# Altium schematic sheet 09.SchDoc
size 297 x 209 mm
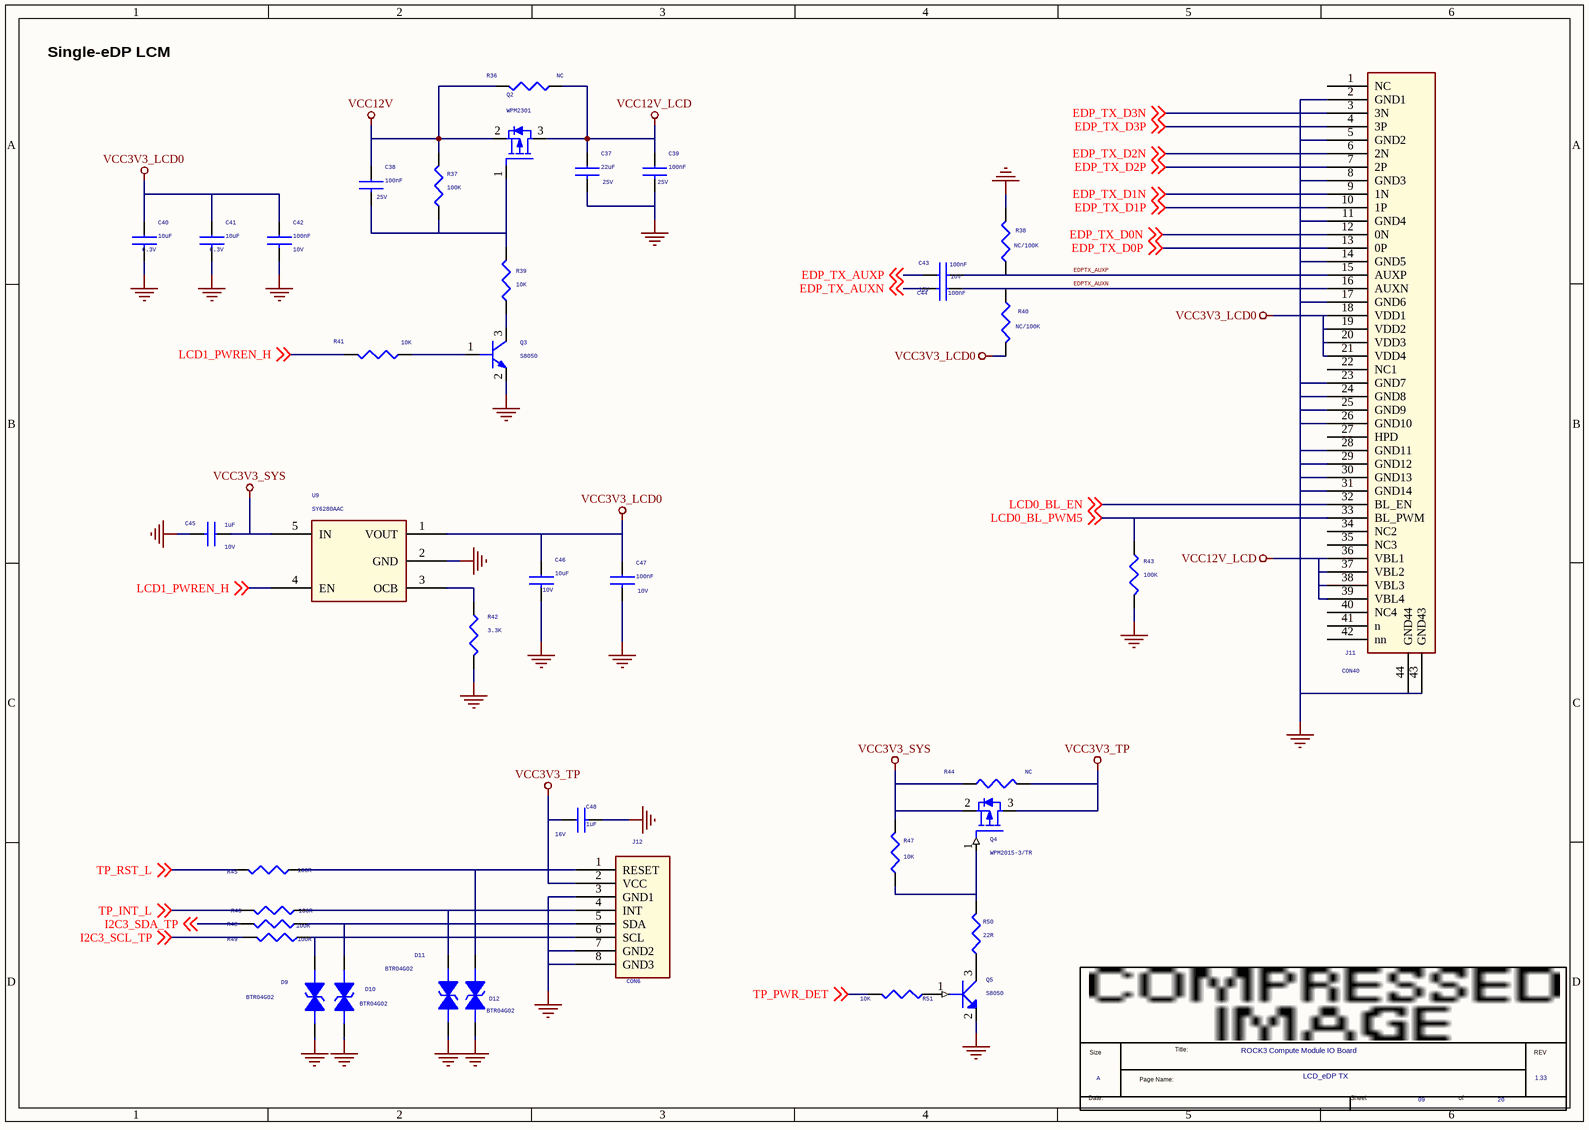
[diagram p0: 09.SchDoc]

## Parts
*  Page Count: 20  Page Number: 09  Page Size: A  Title: ROCK3 Compute Module IO Board  RevCode: 1.33  Doc: LCD_eDP TX  (hidden comment: radxa_1010)  (graphical)
C37  22uF  Voltage: 25V  [C0805]
C38  100nF  Voltage: 25V  [C0402]
C39  100nF  Voltage: 25V  [C0402]
C40  10uF  Voltage: 6.3V  [C0603]
C41  10uF  Voltage: 6.3V  [C0603]
C42  100nF  Voltage: 10V  [C0402]
C43  100nF  Voltage: 10V  [C0402]
C44  100nF  Voltage: 10V  [C0402]
C45  1uF  Voltage: 10V  [C0402]
C46  10uF  Voltage: 10V  [C0603]
C47  100nF  Voltage: 10V  [C0402]
C48  1uF  Voltage: 16V  [C0402]
D9  BTR04G02  [ESD0402_1xD5]
D10  BTR04G02  [ESD0402_1xD5]
D11  BTR04G02  [ESD0402_1xD5]
D12  BTR04G02  [ESD0402_1xD5]
J11  CON40  [20455-040E-TOP]
J12  CON6  [FPC6-0.5MM-2660H]
Q2  WPM2301  [SOT23]
Q3  S8050  [SOT23]
Q4  WPM2015-3/TR  [SOT23]
Q5  S8050  [SOT23]
R36  NC  [R0402]
R37  100K  [R0402]
R38  NC/100K  [R0402]
R39  10K  [R0402]
R40  NC/100K  [R0402]
R41  10K  [R0402]
R42  3.3K  [R0402]
R43  100K  [R0402]
R44  NC  [R0402]
R45  100R  [R0402]
R46  100R  [R0402]
R47  10K  [R0402]
R48  100R  [R0402]
R49  100R  [R0402]
R50  22R  [R0402]
R51  10K  [R0402]
U9  SY6280AAC  [SOT_23_5]

## Nets
GND: C37.2 C39.2 C40.2 C41.2 C42.2 C45.2 C46.2 C47.2 C48.2 D9.1 D10.1 D11.1 D12.1 J11.2(GND1) J11.5(GND2) J11.8(GND3) J11.11(GND4) J11.14(GND5) J11.17(GND6) J11.23(GND7) J11.24(GND8) J11.25(GND9) J11.26(GND10) J11.28(GND11) J11.29(GND12) J11.30(GND13) J11.31(GND14) J11.43(GND43) J11.44(GND44) J12.3(GND1) J12.7(GND2) J12.8(GND3) Q3.2(EMITTER) Q5.2(E) R38.1 R42.2 R43.2 U9.2(GND)
VCC3V3_LCD0: C40.1 C41.1 C42.1 C46.1 C47.1 J11.18(VDD1) J11.19(VDD2) J11.20(VDD3) J11.21(VDD4) R40.2 U9.1(VOUT)
VCC3V3_SYS: C45.1 Q4.2(SOURCE) R44.1 R47.2 U9.5(IN)
VCC3V3_TP: C48.1 J12.2(VCC) Q4.3(DRAIN) R44.2
VCC12V: C38.1 Q2.2(SOURCE) R36.1 R37.1
VCC12V_LCD: C37.1 C39.1 J11.36(VBL1) J11.37(VBL2) J11.38(VBL3) J11.39(VBL4) Q2.3(DRAIN) R36.2
EDP_TX_AUXN: C44.2 ; off-sheet EDP_TX_AUXN
EDP_TX_AUXP: C43.1 ; off-sheet EDP_TX_AUXP
EDP_TX_D0N: J11.12(0N) ; off-sheet EDP_TX_D0N
EDP_TX_D0P: J11.13(0P) ; off-sheet EDP_TX_D0P
EDP_TX_D1N: J11.9(1N) ; off-sheet EDP_TX_D1N
EDP_TX_D1P: J11.10(1P) ; off-sheet EDP_TX_D1P
EDP_TX_D2N: J11.6(2N) ; off-sheet EDP_TX_D2N
EDP_TX_D2P: J11.7(2P) ; off-sheet EDP_TX_D2P
EDP_TX_D3N: J11.3(3N) ; off-sheet EDP_TX_D3N
EDP_TX_D3P: J11.4(3P) ; off-sheet EDP_TX_D3P
EDPTX_AUXN: C44.1 J11.16(AUXN) R40.1
EDPTX_AUXP: C43.2 J11.15(AUXP) R38.2
I2C3_SCL_TP: R49.1 ; off-sheet I2C3_SCL_TP
I2C3_SDA_TP: R48.1 ; off-sheet I2C3_SDA_TP
LCD0_BL_EN: J11.32(BL_EN) ; off-sheet LCD0_BL_EN
LCD0_BL_PWM5: J11.33(BL_PWM) R43.1 ; off-sheet LCD0_BL_PWM5
LCD1_PWREN_H: R41.1 U9.4(EN) ; off-sheet LCD1_PWREN_H
TP_INT_L: R46.1 ; off-sheet TP_INT_L
TP_PWR_DET: R51.2 ; off-sheet TP_PWR_DET
TP_RST_L: R45.1 ; off-sheet TP_RST_L
NetC38_2: C38.2 Q2.1(GATE) R37.2 R39.1
NetD9_2: D9.2 J12.6(SCL) R49.2
NetD10_2: D10.2 J12.5(SDA) R48.2
NetD11_2: D11.2 J12.4(INT) R46.2
NetD12_2: D12.2 J12.1(RESET) R45.2
NetQ3_1: Q3.1(BASE) R41.2
NetQ3_3: Q3.3(COLLECTOR) R39.2
NetQ4_1: Q4.1(GATE) R47.1 R50.2
NetQ5_1: Q5.1(B) R51.1
NetQ5_3: Q5.3(C) R50.1
NetR42_1: R42.1 U9.3(OCB)

Not connected (* = marked no-connect by the designer): J11 1(NC) 22(NC1) 27(HPD) 34(NC2) 35(NC3) 40(NC4) 41(n) 42(nn)

## Notes on the sheet
- Single-eDP LCM
- (in symbol radxa_1010) Title:; Size; REV; Page Name:; Date:; Sheet; of

## Library data of the parts
C37 = CAP NP_0: cap,10.00uF,+/-10%,6.3V,X5R,C0603; Manufacturer PN: C1608X5R0J106K080AB; Manufacturer: TDK; Tolerance: 10%; Priority: A; Dielectric: X5R; Created by: JJJ; Part Type: C0603; RK PN: C1608X5R0J106K080AB
C38 = CAP NP_0: cap,100.00nF,+/-10%,16V,X5R,C0402; Manufacturer: TDK; RK PN: C1005X5R1C104K050BA; Priority: A; Tolerance: 10%; Dielectric: X5R; Part Type: C0402; Manufacturer PN: C1005X5R1C104K050BA; Created by: JJJ
C39 = CAP NP_0: cap,100.00nF,+/-10%,16V,X5R,C0402; Manufacturer PN: C1005X5R1C104K050BA; Manufacturer: TDK; Tolerance: 10%; Priority: A; Dielectric: X5R; Created by: JJJ; Part Type: C0402; RK PN: C1005X5R1C104K050BA
C40 C41 = CAP NP_0: cap,10.00uF,+/-10%,6.3V,X5R,C0603; Manufacturer: TDK; RK PN: C1608X5R0J106K080AB; Priority: A; Tolerance: 10%; Dielectric: X5R; Part Type: C0603; C_Voltage: 6.3V; Manufacturer PN: C1608X5R0J106K080AB; Created by: JJJ
C42-C44 = CAP NP_0: cap,100.00nF,+/-10%,10V,X5R,C0402; Manufacturer PN: C1005X5R1A104K050BA; Manufacturer: TDK; Tolerance: 10%; Priority: A; Dielectric: X5R; Created by: JJJ; Part Type: C0402; RK PN: C1005X5R1A104K050BA
C45 = CAP NP_0: cap,1.00uF,+/-10%,10V,X5R,C0402; Manufacturer PN: C1005X5R1A105K050BB; Manufacturer: TDK; Tolerance: 10%; C_Voltage: 6.3V; Priority: A; Dielectric: X5R; Created by: JJJ; Part Type: C0402; RK PN: C1005X5R1A105K050BB
C46 = CAP NP_0: cap,10.00uF,+/-10%,10V,X5R,C0603; Manufacturer: TDK; RK PN: C1608X5R1A106K080AC; Priority: A; Tolerance: 10%; Dielectric: X5R; Part Type: C0603; Manufacturer PN: C1608X5R1A106K080AC; Created by: JJJ
C47 = CAP NP_0: cap,100.00nF,+/-10%,10V,X5R,C0402; Manufacturer: TDK; RK PN: C1005X5R1A104K050BA; Priority: A; Tolerance: 10%; Dielectric: X5R; Part Type: C0402; Manufacturer PN: C1005X5R1A104K050BA; Created by: JJJ
C48 = CAP NP_0: cap,100.00nF,+/-10%,6.3V,X5R,C0402; Manufacturer: TDK; RK PN: C1005X5R0J104K050BA; Priority: A; Tolerance: 10%; Dielectric: X5R; Part Type: C0402; Manufacturer PN: C1005X5R0J104K050BA; Created by: JJJ
D9 = DIODE BI_DIR TRIG_0: 1-Line, Bi-directional, Transient Voltage Suppressors.17.5pF.; Manufacturer PN: ESD5451N; Manufacturer: WillSemi(韦尔半导体); OPTION: DNP; Priority: A; Created by: JJJ; Part Type: ESD_TVS; RK PN: ESD5451N
D10-D12 = DIODE BI_DIR TRIG_0: 1-Line, Bi-directional, Transient Voltage Suppressors.17.5pF.; Manufacturer: WillSemi(韦尔半导体); RK PN: ESD5451N; Priority: A; OPTION: DNP; Part Type: ESD_TVS; Manufacturer PN: ESD5451N; Created by: JJJ
J11 = CON40_1
J12 = CON6_1
Q2 = MOSFET P_Dup1: PMOS,WPM3407-3/TR,SOT_23,Id=4.4A,Vds=30V; Manufacturer: WillSemi(韦尔半导体); Priority: A; Id_max: 4.4A; Vgs: ±20V; VDS: 30V; Vgsth: 2.0V; Pd: 0.9W; RK PN: WPM3407-3/TR; Part Type: PMOS; Manufacturer PN: WPM3407-3/TR; Created by: JJJ
Q3 = NPN: S8050,SOT23; Manufacturer: 长电; Manufacturer PN: S8050_SOT23; Priority: A; Ic: 0.5A; Vceo: 25V; Pc: 0.3W; RK PN: S8050; Part Type: NPN; Created by: JJJ
Q4 = MOSFET P: PMOS,WPM2015-3/TR,SOT_23,Id=2.4A,Vds=20V; Manufacturer: WillSemi(韦尔半导体); ROOM: CHG; Priority: A; Id_max: 2.4A; Vgs: ±8V; VDS: 20V; Vgsth: 0.62V; Pd: 0.5W; option: DNP; RK PN: WPM2015-3/TR; Part Type: PMOS; Manufacturer PN: WPM2015-3/TR; Created by: JJJ
Q5 = NPN4
R36 R41 = RESISTOR_0: 通用厚膜电阻,10K,+/-5%,R0402,1/16W.; Manufacturer: YAGEO; Tolerance: 5%; RK PN: RC0402JR-0710KL; Priority: A; Wattage: 1/16W; Part Type: 通用厚膜电阻; Manufacturer PN: RC0402JR-0710KL; Created by: YTL
R37 R43 R45 R49 = RESISTOR_0: 通用厚膜电阻,100K,+/-5%,R0402,1/16W.; Manufacturer: YAGEO; Tolerance: 5%; RK PN: RC0402JR-07100KL; Priority: A; Wattage: 1/16W; Part Type: 通用厚膜电阻; Manufacturer PN: RC0402JR-07100KL; Created by: YTL
R38 = RESISTOR_0: 通用厚膜电阻,100K,+/-5%,R0402,1/16W.; Manufacturer PN: RC0402JR-07100KL; Manufacturer: YAGEO; Tolerance: 5%; Option: DNP; Wattage: 1/16W; Priority: A; Created by: YTL; Part Type: 通用厚膜电阻; RK PN: RC0402JR-07100KL
R39 R47 = RESISTOR_0: 通用厚膜电阻,10K,+/-5%,R0402,1/16W.; Manufacturer PN: RC0402JR-0710KL; Manufacturer: YAGEO; Tolerance: 5%; Wattage: 1/16W; Priority: A; Created by: YTL; Part Type: 通用厚膜电阻; RK PN: RC0402JR-0710KL
R40 = RESISTOR_0: 通用厚膜电阻,100K,+/-5%,R0402,1/16W.; Manufacturer: YAGEO; Tolerance: 5%; Option: DNP; RK PN: RC0402JR-07100KL; Priority: A; Wattage: 1/16W; Part Type: 通用厚膜电阻; Manufacturer PN: RC0402JR-07100KL; Created by: YTL
R42 = RESISTOR_0: 通用厚膜电阻,4K7,+/-5%,R0402,1/16W.; Manufacturer PN: RC0402JR-074K7L; Manufacturer: YAGEO; Tolerance: 5%; Wattage: 1/16W; Priority: A; Created by: YTL; Part Type: 通用厚膜电阻; RK PN: RC0402JR-074K7L
R44 = RESISTOR_0: 通用厚膜电阻,0R,+/-5%,R0402,1/16W.; Manufacturer: YAGEO; Tolerance: 5%; RK PN: RC0402JR-070RL; Priority: A; Wattage: 1/16W; Part Type: 通用厚膜电阻; Manufacturer PN: RC0402JR-070RL; Created by: YTL
R46 R48 R51 = RESISTOR_0: 通用厚膜电阻,100K,+/-5%,R0402,1/16W.; Manufacturer PN: RC0402JR-07100KL; Manufacturer: YAGEO; Tolerance: 5%; Wattage: 1/16W; Priority: A; Created by: YTL; Part Type: 通用厚膜电阻; RK PN: RC0402JR-07100KL
R50 = RESISTOR_0_Dup1
U9 = SWITCH_SY6280: Low Loss Power Distribution Switch; Manufacturer: Silergy（矽力杰）; Priority: A; Created by: JJJ; Manufacturer PN: SY6280AAC; Part Type: Switch; RK PN: SY6280AAC
* = radxa_1010: Page Create Date: March  8, 1995